# EAGLE design bdm (EAGLE 9.5.2)
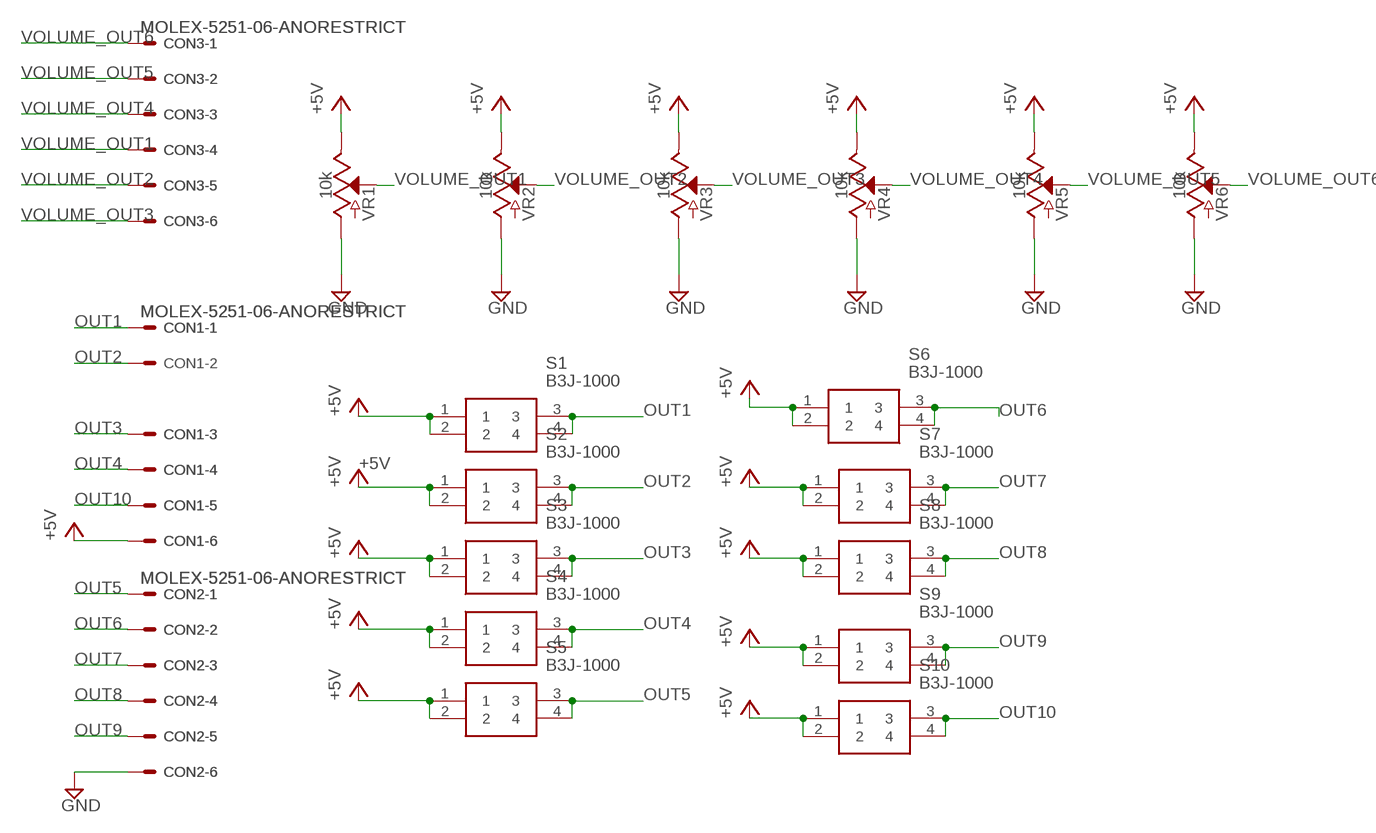
[diagram p0: schematic, sheet 1]

## Parts
CON1  MOLEX-5251-06-ANORESTRICT  [5251-06-ANORESTRICT]
CON2  MOLEX-5251-06-ANORESTRICT  [5251-06-ANORESTRICT]
CON3  MOLEX-5251-06-ANORESTRICT  [5251-06-ANORESTRICT]
S1  B3J-1000  [B3J-1_00]
S2  B3J-1000  [B3J-1_00]
S3  B3J-1000  [B3J-1_00]
S4  B3J-1000  [B3J-1_00]
S5  B3J-1000  [B3J-1_00]
S6  B3J-1000  [B3J-1_00]
S7  B3J-1000  [B3J-1_00]
S8  B3J-1000  [B3J-1_00]
S9  B3J-1000  [B3J-1_00]
S10  B3J-1000  [B3J-1_00]
VR1  10k  POTENTIOMETER_SLIDE-20MM-1/10W-20%  [SLIDER-SMALL]
VR2  10k  POTENTIOMETER_SLIDE-20MM-1/10W-20%  [SLIDER-SMALL]
VR3  10k  POTENTIOMETER_SLIDE-20MM-1/10W-20%  [SLIDER-SMALL]
VR4  10k  POTENTIOMETER_SLIDE-30MM-1/10W-20%  [SLIDER-MEDIUM]
VR5  10k  POTENTIOMETER_SLIDE-30MM-1/10W-20%  [SLIDER-MEDIUM]
VR6  10k  POTENTIOMETER_SLIDE-30MM-1/10W-20%  [SLIDER-MEDIUM]

## Nets
+5V: CON1.6 S1.1 S1.2 S2.1 S2.2 S3.1 S3.2 S4.1 S4.2 S5.1 S5.2 S6.1 S6.2 S7.1 S7.2 S8.1 S8.2 S9.1 S9.2 S10.1 S10.2 VR1.TOP(E) VR2.TOP(E) VR3.TOP(E) VR4.TOP(E) VR5.TOP(E) VR6.TOP(E)
GND: CON2.6 VR1.BOTTOM(A) VR2.BOTTOM(A) VR3.BOTTOM(A) VR4.BOTTOM(A) VR5.BOTTOM(A) VR6.BOTTOM(A)
OUT1: CON1.1 S1.3 S1.4
OUT2: CON1.2 S2.3 S2.4
OUT3: CON1.3 S3.3 S3.4
OUT4: CON1.4 S4.3 S4.4
OUT5: CON2.1 S5.3 S5.4
OUT6: CON2.2 S6.3 S6.4
OUT7: CON2.3 S7.3 S7.4
OUT8: CON2.4 S8.3 S8.4
OUT9: CON2.5 S9.3 S9.4
OUT10: CON1.5 S10.3 S10.4
VOLUME_OUT1: CON3.4 VR1.WIPER(S)
VOLUME_OUT2: CON3.5 VR2.WIPER(S)
VOLUME_OUT3: CON3.6 VR3.WIPER(S)
VOLUME_OUT4: CON3.3 VR4.WIPER(S)
VOLUME_OUT5: CON3.2 VR5.WIPER(S)
VOLUME_OUT6: CON3.1 VR6.WIPER(S)

## Library data of the parts
CON1-CON3 = Connector_Robotech:MOLEX-5251-06: CONNECTOR Molex 5251 6-pin wire to board 2.54 mm (.1 inch) pitch header
S1-S10 = Passive_Robotech:B3J-1000: Grey Button Tactile Switch, SPST-NO 0.05 A@ 24 V dc 6.8mm Source: Datasheet <https://omronfs.omron.com/en_US/ecb/products/pdf/en-b3j.pdf>; DESCRIPTION: Grey Button Tactile Switch, SPST-NO 0.05 A@ 24 V dc 6.8mm; DIGIKEY_PART_NUMBER: SW819-ND; DIGIKEY_PRICE-STOCK: https://www.digikey.co.uk/product-detail/en/omron-electronics-inc-emc-div/B3J-1000/SW819-ND/700003; HEIGHT: mm; MANUFACTURER_NAME: Omron Electronics; MANUFACTURER_PART_NUMBER: B3J-1000
VR1-VR3 = SparkFun-Resistors:POTENTIOMETER_SLIDE: Slide Potentiometer Slide-type potentiometers - pots that are adjusted by sliding a wiper up or down. Commonly found en-masse on sound boards. Variants 60MM - Slide Pot - X-Large (10k Linear Taper) <https://www.sparkfun.com/products/9119> (COM-09119) 10k linear slide pot with 60mm travel. Datasheet <http://cdn.sparkfun.com/datasheets/Components/Switches/SC608N-b10k.pdf> 30MM, 30MM-KIT - Slide Pot - Medium (10k Linear Taper) <https://www.sparkfun.com/products/11621> (COM-11621) 10k linear slide pot with 30mm travel. Datasheet <http://cdn.sparkfun.com/datasheets/Components/Switches/C-31-.pdf> (C3031N-1A2-B10K-GP) "KIT" variant, intended for soldering kits, has tStop removed from pads so the component can only be stuffed on one side of the board. 20MM - Slide Pot - Small (10k Linear Taper) <https://www.sparkfun.com/products/11620> (COM-11620) 10k linear slide pot with 20mm travel. Datasheet <http://cdn.sparkfun.com/datasheets/Components/Switches/C-31-.pdf> (C2031N-1A2-B10K-GP); PROD_ID: RES-11924; SF_SKU: COM-11620
VR4-VR6 = SparkFun-Resistors:POTENTIOMETER_SLIDE: Slide Potentiometer Slide-type potentiometers - pots that are adjusted by sliding a wiper up or down. Commonly found en-masse on sound boards. Variants 60MM - Slide Pot - X-Large (10k Linear Taper) <https://www.sparkfun.com/products/9119> (COM-09119) 10k linear slide pot with 60mm travel. Datasheet <http://cdn.sparkfun.com/datasheets/Components/Switches/SC608N-b10k.pdf> 30MM, 30MM-KIT - Slide Pot - Medium (10k Linear Taper) <https://www.sparkfun.com/products/11621> (COM-11621) 10k linear slide pot with 30mm travel. Datasheet <http://cdn.sparkfun.com/datasheets/Components/Switches/C-31-.pdf> (C3031N-1A2-B10K-GP) "KIT" variant, intended for soldering kits, has tStop removed from pads so the component can only be stuffed on one side of the board. 20MM - Slide Pot - Small (10k Linear Taper) <https://www.sparkfun.com/products/11620> (COM-11620) 10k linear slide pot with 20mm travel. Datasheet <http://cdn.sparkfun.com/datasheets/Components/Switches/C-31-.pdf> (C2031N-1A2-B10K-GP); PROD_ID: RES-11931; SF_SKU: COM-11621

## Board
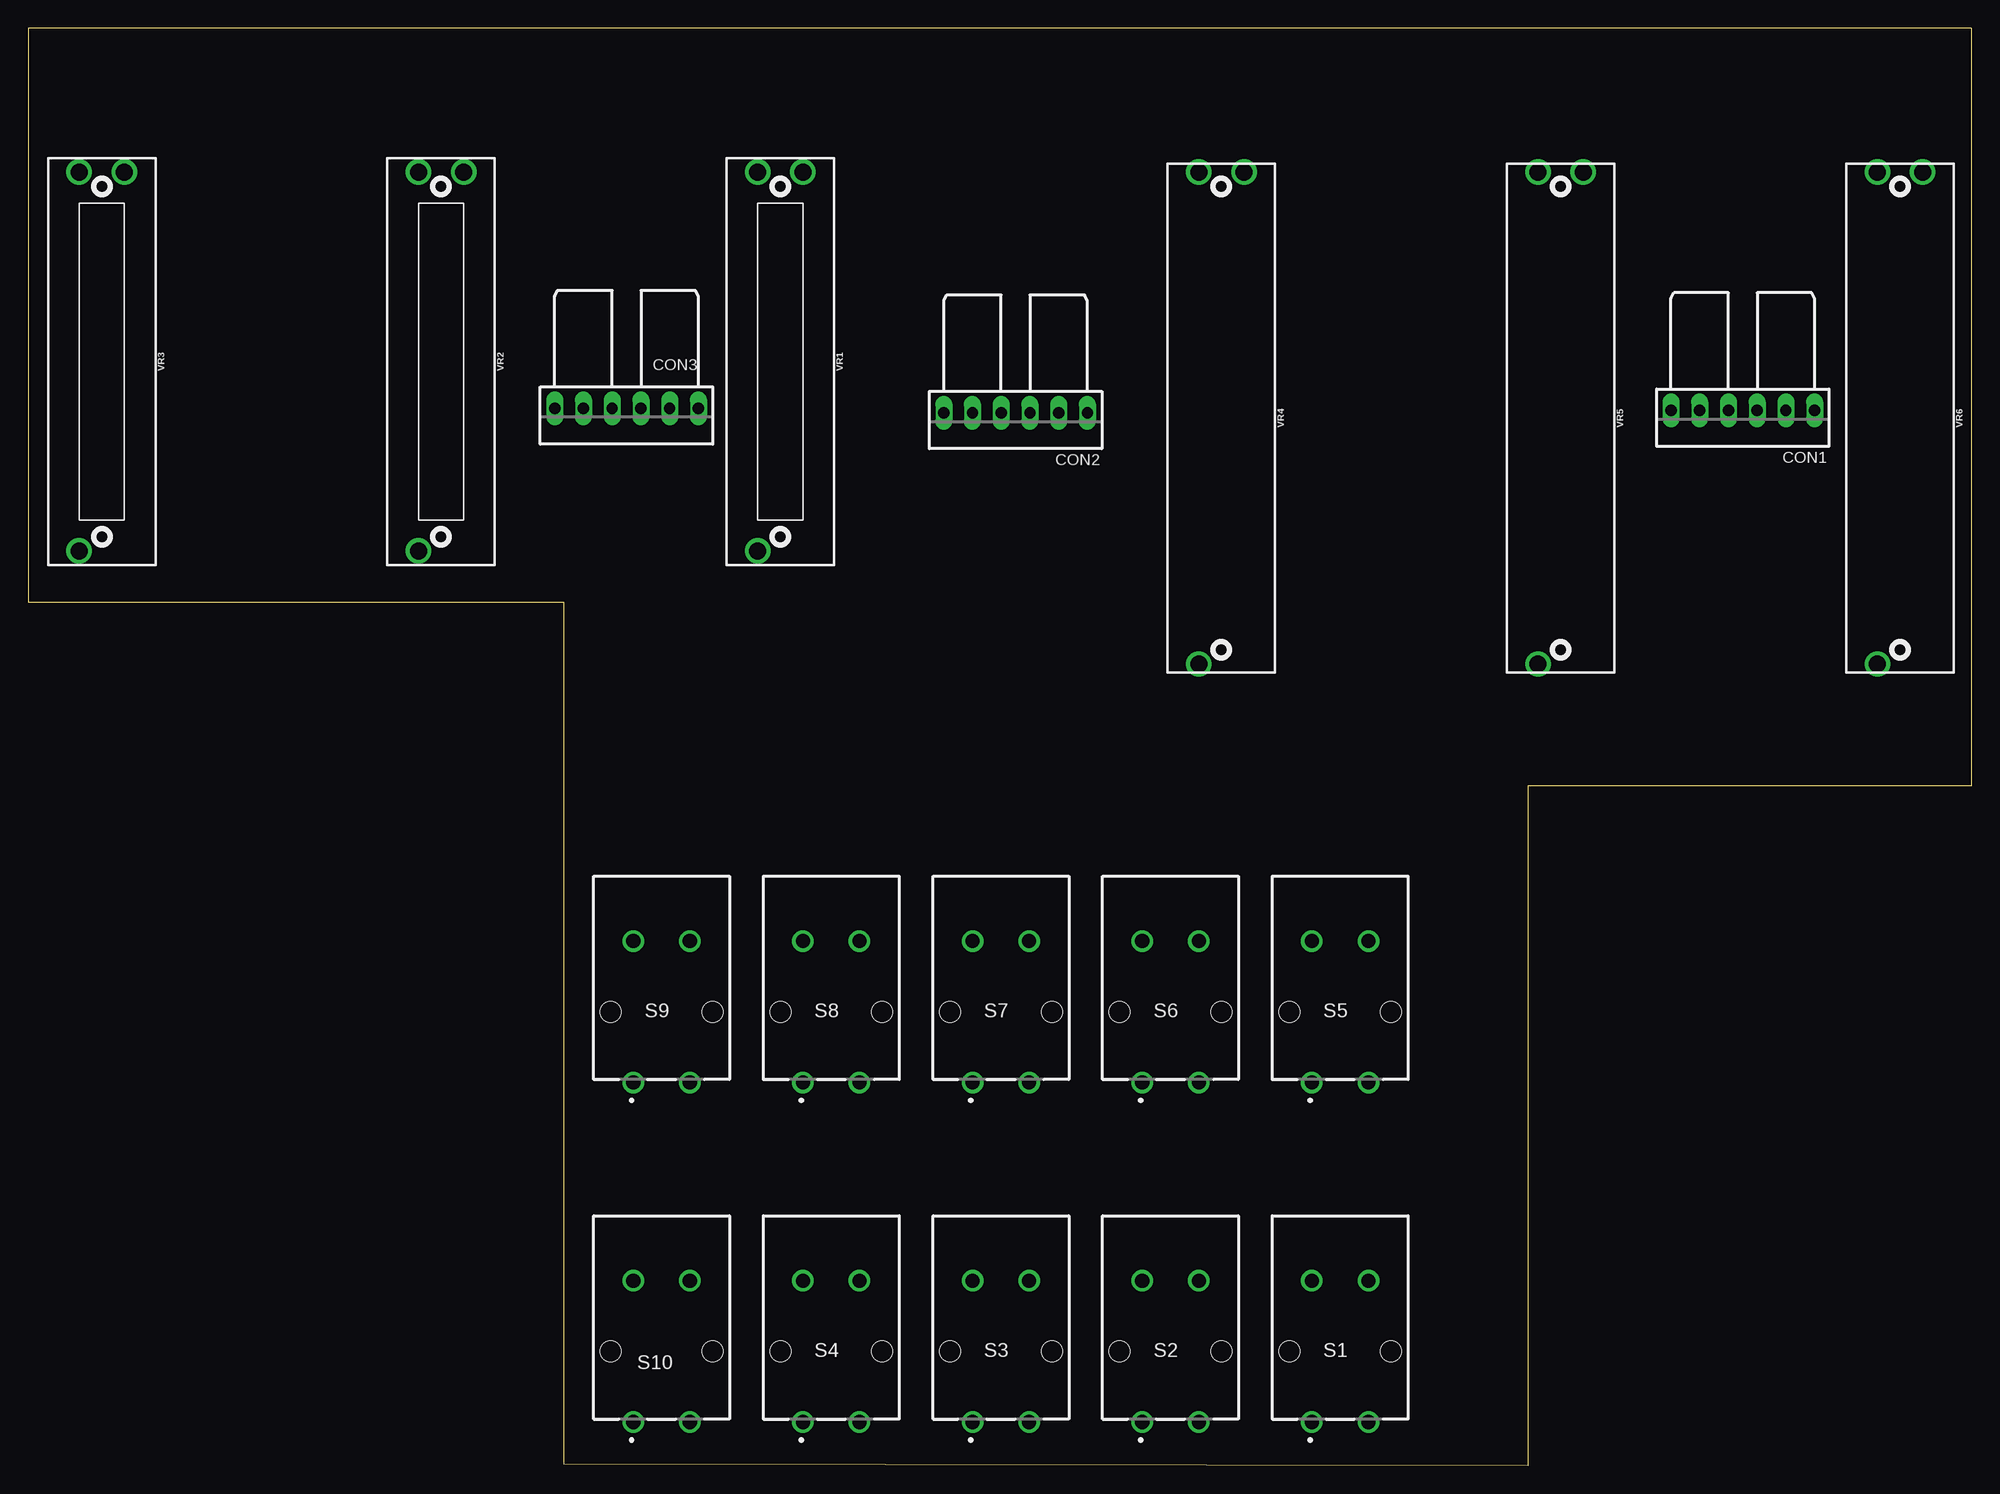
[diagram p1: board, top side]
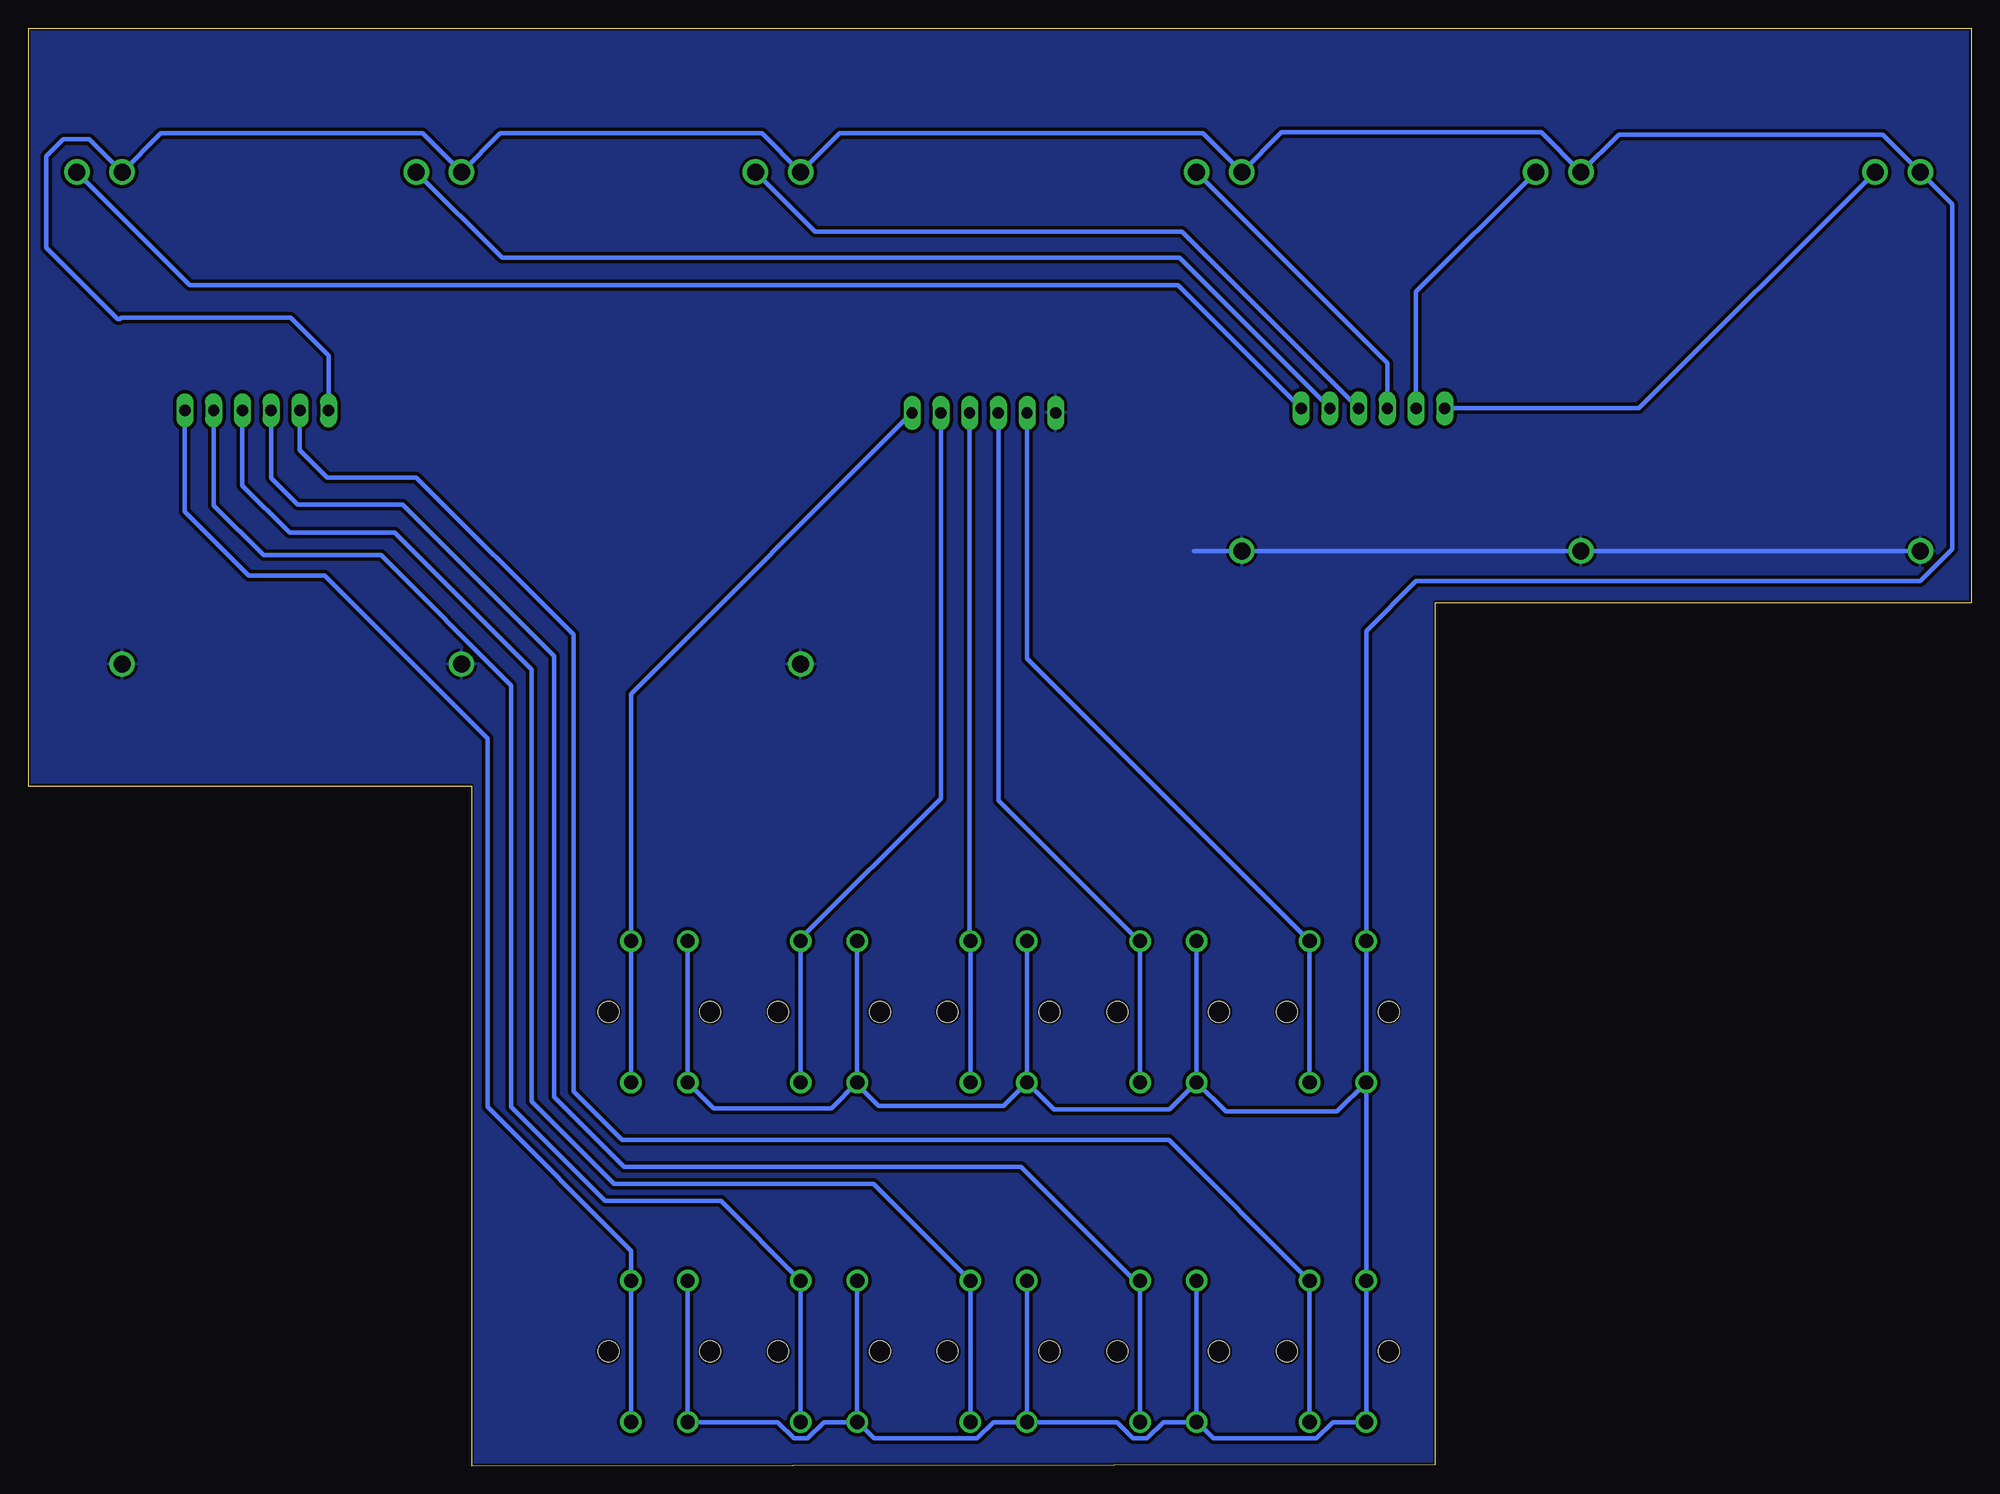
[diagram p2: board, bottom side, seen from below]

Size 171.8 x 127.1 mm. Coordinates in mm from the lower left corner, seen from the top.
Outline: 171.8,127.1 0,127.1 0,76.3 47.4,76.3 47.4,0.1 132.6,0 132.6,60.1 171.8,60.1 171.8,127.1
Copper layers (1*16): Top 0.0356mm / dielectric 1.5011mm / Bottom 0.0356mm
Design rules "formita": minimum track width 10mil, minimum drill 0.5994mm, track to track 0.3mm, track to pad 0.3mm, pad to pad 0.3mm, via to via 0.3mm, smd to smd 8mil, copper to edge 8mil, drill to drill 8mil, minimum pad ring 10mil, minimum via ring 8mil, stop-mask expansion 4mil, vias tented up to drill 1mm, thermal gap 10mil

### Footprints (pad centres in the part's own frame; a part is rotated, then mirrored left to right if it is on the bottom)
5251-06-ANORESTRICT = drill 1 long: 1 6.35,0; 2 3.81,0; 3 1.27,0; 4 -1.27,0; 5 -3.81,0; 6 -6.35,0
B3J-1_00 = drill 1.25 pad 1.9: 1 -2.5,-6.25; 2 -2.5,6.25; 3 2.5,-6.25; 4 2.5,6.25 | hole 1.85: -4.5,0; 4.5,0
SLIDER-SMALL = drill 1.5: BOTTOM 16.75,-2; TOP -16.75,-2; WIPER -16.75,2
SLIDER-MEDIUM = drill 1.5: BOTTOM 21.75,-2; TOP -21.75,-2; WIPER -21.75,2

### Placement (x,y rotation side)
CON1  151.6,93.3 0 top
CON2  87.3,93.1 0 top
CON3  52.9,93.5 0 top
S1  116,10.1 0 top
S2  101,10.1 0 top
S3  86,10.1 0 top
S4  71,10.1 0 top
S5  116,40.13 0 top
S6  101,40.13 0 top
S7  86,40.13 0 top
S8  71,40.13 0 top
S9  56,40.13 0 top
S10  56,10.1 0 top
VR1  66.5,97.63 270 top
VR2  36.5,97.63 270 top
VR3  6.5,97.63 270 top
VR4  105.5,92.63 270 top
VR5  135.5,92.63 270 top
VR6  165.5,92.63 270 top

### Tracks (layer width: path | path; a pad name or v marks a point on that pad's centre or on a via)
+5V
  Bottom 0.406: 113.5,33.9 S5.1 | S9.1 56.08,31.3 65.92,31.3 S8.1 | S8.1 70.88,31.5 81.12,31.5 S7.1 | S7.1 85.58,31.8 96.6,31.8 98.5,33.7 S6.1 | S6.1 100.78,31.6 111.2,31.6 113.5,33.9 | S5.2 113.5,33.9 | S6.2 S6.1 | S8.2 S8.1 | S9.1 S9.2 53.5,73.8 49.1,78.2 4.5,78.2 1.67,81.03 1.67,111.55 VR3.TOP 7.8,117.68 7.8,117.7 31.18,117.7 VR2.TOP 38.02,117.9 60.98,117.9 VR1.TOP 67.92,117.8 100.08,117.8 VR4.TOP 106.92,117.8 130.08,117.8 VR5.TOP 136.92,117.8 160.08,117.8 VR6.TOP 166.42,117.3 168.7,117.3 170.2,115.8 170.2,107.7 163.9,101.4 163.7,101.4 163.6,101.5 148.6,101.5 145.25,98.15 CON1.6 | S2.2 98.5,3.9 | 98.5,3.9 S2.1 101.44,3.85 102.9,2.4 104.1,2.4 105.56,3.85 S1.1 S1.2 | 68.5,3.9 S4.1 71.44,3.85 72.9,2.4 74.1,2.4 75.56,3.85 S3.1 | 68.5,3.9 67,2.4 57.9,2.4 56.45,3.85 S10.1 S10.2 S9.1 | S3.1 86.44,3.85 87.9,2.4 97,2.4 98.5,3.9 | S3.2 S3.1 | S4.2 68.5,3.9 | S7.2 S7.1
GND
  Bottom 0.406: VR3.BOTTOM VR2.BOTTOM VR1.BOTTOM 68.73,80.88
  pour Bottom: 0,127.1 0,76.3 47.4,76.3 47.4,0.1 132.6,0.1 132.6,60.1 171.8,60.1 171.8,127.1
OUT1
  Bottom 0.406: S1.3 S1.4 118.5,19 131.2,31.7 131.2,64.3 145.59,78.69 152.29,78.69 157.95,84.35 CON1.1
OUT2
  Bottom 0.406: S2.3 S2.4 110.55,23.4 120.8,23.4 129.1,31.7 129.1,69 140.6,80.5 151,80.5 155.41,84.91 CON1.2
OUT3
  Bottom 0.406: S3.3 S3.4 97.05,24.9 120,24.9 127.3,32.2 127.3,70.4 139.4,82.5 148.7,82.5 152.87,86.67 CON1.3
OUT4
  Bottom 0.406: S4.4 73.5,15.9 | 73.5,15.9 S4.3 | 73.5,15.9 84,26.4 119.1,26.4 125.3,32.6 125.3,71.6 138.7,85 148,85 150.33,87.33 CON1.4
OUT5
  Bottom 0.406: CON2.1 118.5,68.25 S5.4 S5.3
OUT6
  Bottom 0.406: S6.3 S6.4 103.5,46.6 91.11,58.99 CON2.2
OUT7
  Bottom 0.406: S7.3 S7.4 88.57,46.45 CON2.3
OUT8
  Bottom 0.406: S8.4 73.5,46.3 | 73.5,46.3 S8.3 | CON2.4 86.03,58.83 73.5,46.3
OUT9
  Bottom 0.406: S9.3 S9.4 83.49,71.37 CON2.5
OUT10
  Bottom 0.406: S10.3 S10.4 70.95,28.8 119.3,28.8 123.6,33.1 123.6,73.5 137.49,87.39 145.37,87.39 147.79,89.81 CON1.5
VOLUME_OUT1
  Bottom 0.406: CON3.4 51.63,97.51 VR1.WIPER
VOLUME_OUT2
  Bottom 0.406: CON3.5 49.09,103.79 VR2.WIPER
VOLUME_OUT3
  Bottom 0.406: VR3.WIPER 29.38,93.5 CON3.6
VOLUME_OUT4
  Bottom 0.406: CON3.3 69.77,109.1 102.22,109.1 VR4.WIPER
VOLUME_OUT5
  Bottom 0.406: CON3.2 70.01,106.8 129.92,106.8 VR5.WIPER
VOLUME_OUT6
  Bottom 0.406: CON3.1 70.15,104.4 157.52,104.4 VR6.WIPER